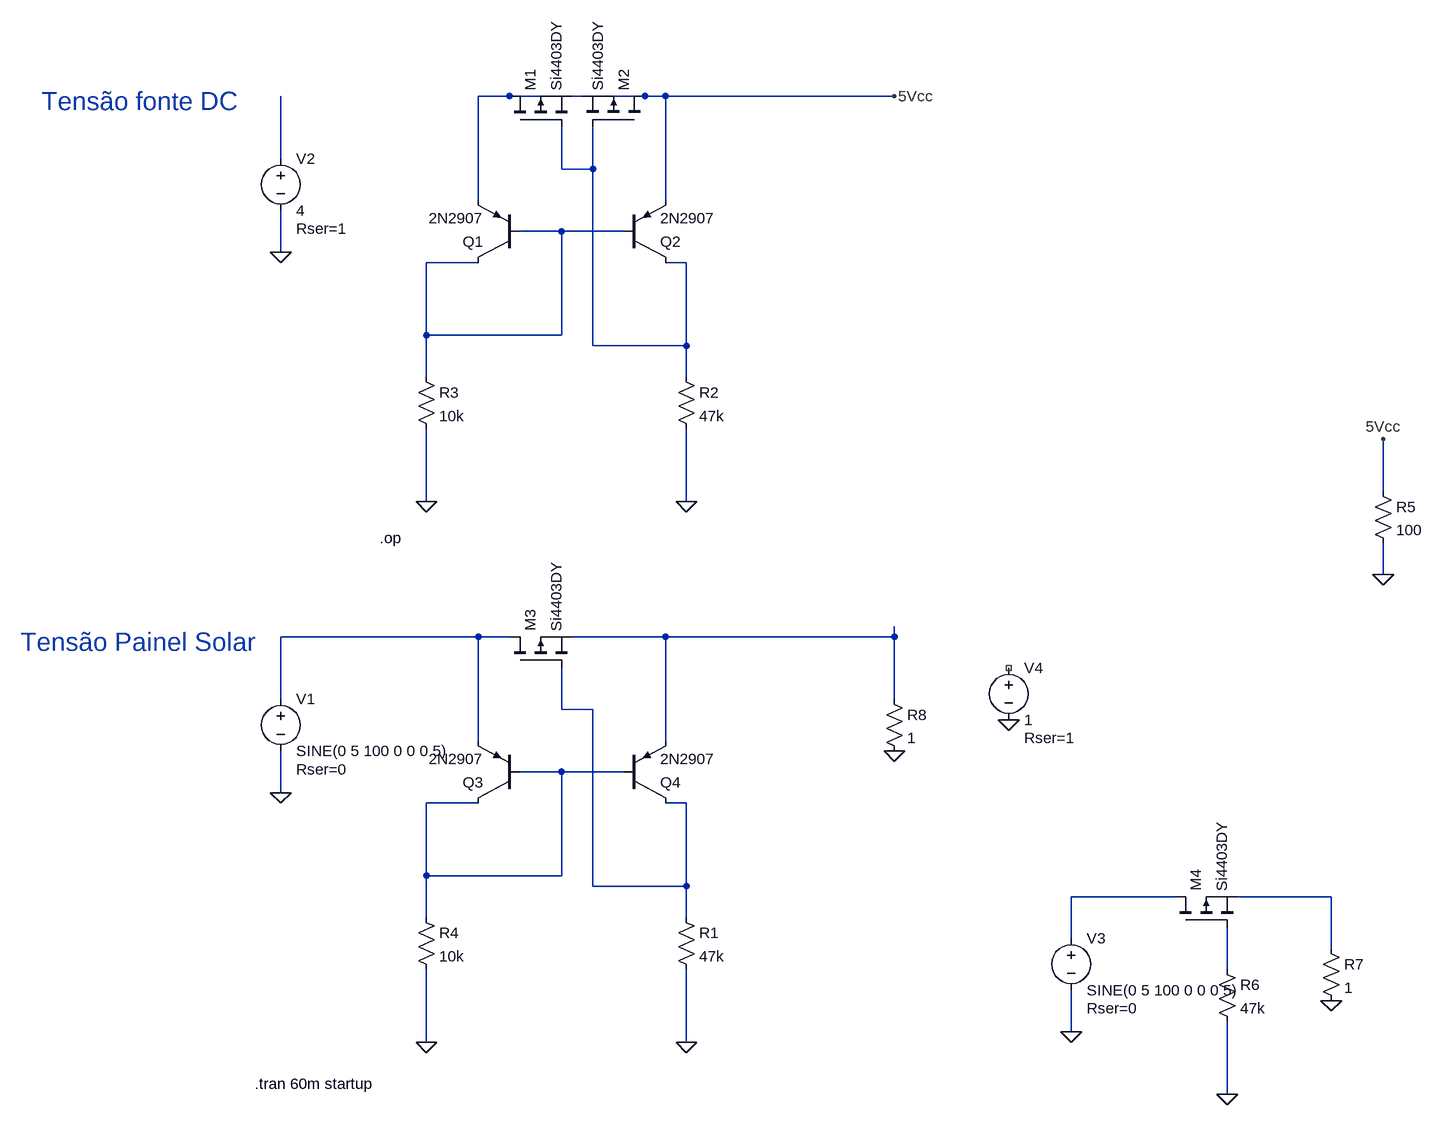
[diagram p0: schematic zvd.asc]
zvd.asc, the LTspice schematic file:
Version 4
SHEET 1 2104 1796
WIRE 64 240 16 240
WIRE 112 240 64 240
WIRE 176 240 160 240
WIRE 272 240 208 240
WIRE 304 240 272 240
WIRE 656 240 304 240
WIRE -288 336 -288 240
WIRE 144 352 144 288
WIRE 192 352 192 288
WIRE 192 352 144 352
WIRE 16 400 16 240
WIRE 304 400 304 240
WIRE 144 448 80 448
WIRE 240 448 144 448
WIRE -288 480 -288 416
WIRE 16 496 -64 496
WIRE 336 496 304 496
WIRE -64 608 -64 496
WIRE 144 608 144 448
WIRE 144 608 -64 608
WIRE 192 624 192 352
WIRE 336 624 336 496
WIRE 336 624 192 624
WIRE -64 672 -64 608
WIRE 336 672 336 624
WIRE 1408 848 1408 768
WIRE -64 864 -64 752
WIRE 336 864 336 752
WIRE 1408 976 1408 928
WIRE 16 1072 -288 1072
WIRE 64 1072 16 1072
WIRE 304 1072 160 1072
WIRE 656 1072 656 1056
WIRE 656 1072 304 1072
WIRE -288 1168 -288 1072
WIRE 656 1168 656 1072
WIRE 144 1184 144 1120
WIRE 192 1184 144 1184
WIRE 16 1232 16 1072
WIRE 304 1232 304 1072
WIRE 144 1280 80 1280
WIRE 240 1280 144 1280
WIRE -288 1312 -288 1248
WIRE 16 1328 -64 1328
WIRE 336 1328 304 1328
WIRE -64 1440 -64 1328
WIRE 144 1440 144 1280
WIRE 144 1440 -64 1440
WIRE 192 1456 192 1184
WIRE 336 1456 336 1328
WIRE 336 1456 192 1456
WIRE 1088 1472 928 1472
WIRE 1328 1472 1184 1472
WIRE -64 1504 -64 1440
WIRE 336 1504 336 1456
WIRE 928 1536 928 1472
WIRE 1328 1552 1328 1472
WIRE 1168 1584 1168 1520
WIRE 928 1680 928 1616
WIRE -64 1696 -64 1584
WIRE 336 1696 336 1584
WIRE 1168 1776 1168 1664
FLAG -64 864 0
FLAG 336 864 0
FLAG -288 480 0
FLAG -64 1696 0
FLAG 336 1696 0
FLAG -288 1312 0
FLAG 656 240 5Vcc
FLAG 1408 976 0
FLAG 1408 768 5Vcc
FLAG 928 1680 0
FLAG 1168 1776 0
FLAG 1328 1632 0
FLAG 656 1248 0
FLAG 832 1200 0
DATAFLAG 384 240 ""
DATAFLAG 384 1072 ""
DATAFLAG 560 1072 ""
DATAFLAG -144 1072 ""
DATAFLAG -64 1472 ""
DATAFLAG 336 1456 ""
DATAFLAG 16 1168 "$-V(N009)"
DATAFLAG 1040 1472 ""
DATAFLAG 1312 1472 ""
DATAFLAG 1168 1552 ""
SYMBOL pmos 64 288 R270
SYMATTR InstName M1
SYMATTR Value Si4403DY
SYMBOL pnp 80 496 R180
SYMATTR InstName Q1
SYMATTR Value 2N2907
SYMBOL pnp 240 496 M180
SYMATTR InstName Q2
SYMATTR Value 2N2907
SYMBOL res 320 656 R0
SYMATTR InstName R2
SYMATTR Value 47k
SYMBOL res -80 656 R0
SYMATTR InstName R3
SYMATTR Value 10k
SYMBOL voltage -288 320 R0
WINDOW 123 0 0 Left 0
WINDOW 39 24 124 Left 2
SYMATTR SpiceLine Rser=1
SYMATTR InstName V2
SYMATTR Value 4
SYMBOL pmos 272 288 M270
SYMATTR InstName M2
SYMATTR Value Si4403DY
SYMBOL pmos 64 1120 R270
SYMATTR InstName M3
SYMATTR Value Si4403DY
SYMBOL pnp 80 1328 R180
SYMATTR InstName Q3
SYMATTR Value 2N2907
SYMBOL pnp 240 1328 M180
SYMATTR InstName Q4
SYMATTR Value 2N2907
SYMBOL res 320 1488 R0
SYMATTR InstName R1
SYMATTR Value 47k
SYMBOL res -80 1488 R0
SYMATTR InstName R4
SYMATTR Value 10k
SYMBOL voltage -288 1152 R0
WINDOW 123 0 0 Left 0
WINDOW 39 24 124 Left 2
SYMATTR SpiceLine Rser=0
SYMATTR InstName V1
SYMATTR Value SINE(0 5 100 0 0 0 5)
SYMBOL res 1392 832 R0
SYMATTR InstName R5
SYMATTR Value 100
SYMBOL pmos 1088 1520 R270
SYMATTR InstName M4
SYMATTR Value Si4403DY
SYMBOL res 1152 1568 R0
SYMATTR InstName R6
SYMATTR Value 47k
SYMBOL res 1312 1536 R0
SYMATTR InstName R7
SYMATTR Value 1
SYMBOL res 640 1152 R0
SYMATTR InstName R8
SYMATTR Value 1
SYMBOL voltage 928 1520 R0
WINDOW 123 0 0 Left 0
WINDOW 39 24 124 Left 2
SYMATTR SpiceLine Rser=0
SYMATTR InstName V3
SYMATTR Value SINE(0 5 100 0 0 0 5)
SYMBOL voltage 832 1104 R0
WINDOW 123 0 0 Left 0
WINDOW 39 24 124 Left 2
SYMATTR InstName V4
SYMATTR Value 1
SYMATTR SpiceLine Rser=1
TEXT -656 248 Left 4 ;Tensão fonte DC
TEXT -328 1760 Left 2 !.tran 60m startup
TEXT -688 1080 Left 4 ;Tensão Painel Solar
TEXT -136 920 Left 2 !.op

The netlist it stands for:
* zvd.asc
M1 N001 N004 N002 N002 Si4403DY
Q1 N005 N005 N001 0 2N2907
Q2 N004 N005 5Vcc 0 2N2907
R2 N004 0 47k
R3 N005 0 10k
V2 N003 0 4 Rser=1
M2 5Vcc N004 N002 N002 Si4403DY
M3 N006 N008 N007 N007 Si4403DY
Q3 N009 N009 N006 0 2N2907
Q4 N008 N009 N007 0 2N2907
R1 N008 0 47k
R4 N009 0 10k
V1 N006 0 SINE(0 5 100 0 0 0 5) Rser=0
R5 5Vcc 0 100
M4 N010 N012 N011 N011 Si4403DY
R6 N012 0 47k
R7 N011 0 1
R8 N007 0 1
V3 N010 0 SINE(0 5 100 0 0 0 5) Rser=0
V4 NC_01 0 1 Rser=1
.model NPN NPN
.model PNP PNP
.lib standard.bjt
.model NMOS NMOS
.model PMOS PMOS
.lib standard.mos
* Tensão fonte DC
.tran 60m startup
* Tensão Painel Solar
.op
.backanno
.end